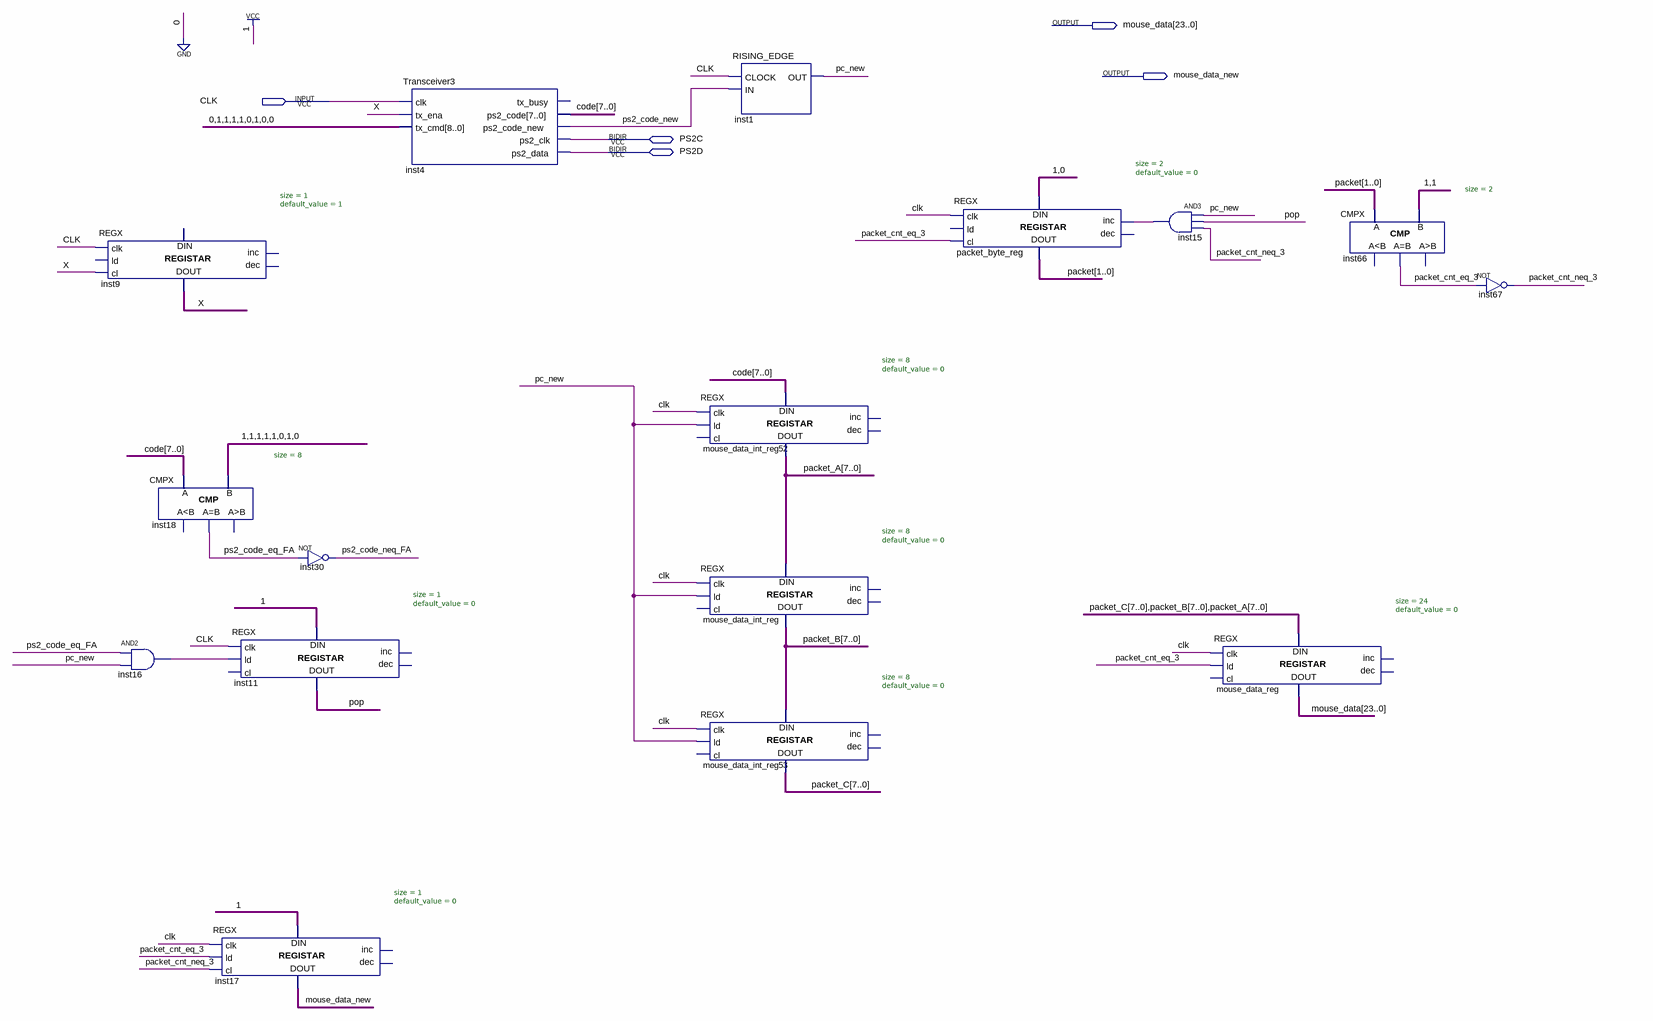
[diagram p0: schematic sheet]
// Quartus schematic transmit_test.bdf as structural Verilog: 16 symbols, 5 pins
module transmit_test (
  input  CLK,
  inout  PS2C,
  inout  PS2D,
  output [23:0] mouse_data,
  output mouse_data_new
);

  wire inst15_out, inst16_out, packet_cnt_eq_3, packet_cnt_neq_3, pc_new, pop, ps2_code_eq_FA,
       ps2_code_neq_FA, ps2_code_new, X;
  wire [1:0] packet;
  wire [7:0] code, packet_A, packet_B, packet_C;

  REGX #(.size(1), .default_value(1)) inst9 (.clk(CLK), .cl(X), .data_out(X));  // open: ld, inc, dec, data_in
  and inst16 (inst16_out, ps2_code_eq_FA, pc_new);
  CMPX #(.size(8)) inst18 (.A(code), .B(8'b11111010), .eq(ps2_code_eq_FA));  // open: ls, gr
  REGX #(.size(1), .default_value(0)) inst11 (
    .clk(CLK), .ld(inst16_out), .data_in(1'b1), .data_out(pop));  // open: cl, inc, dec
  REGX #(.size(1), .default_value(0)) inst17 (
    .clk(CLK), .ld(packet_cnt_eq_3), .cl(packet_cnt_neq_3), .data_in(1'b1), .data_out(mouse_data_new));  // open: inc, dec
  not inst30 (ps2_code_neq_FA, ps2_code_eq_FA);
  Transceiver3 inst4 (
    .clk(CLK), .tx_ena(X), .tx_cmd(9'b011110100), .ps2_code(code), .ps2_code_new(ps2_code_new),
    .ps2_clk(PS2C), .ps2_data(PS2D));  // open: tx_busy
  RISING_EDGE inst1 (.CLOCK(CLK), .IN(ps2_code_new), .OUT(pc_new));
  REGX #(.size(8), .default_value(0)) mouse_data_int_reg52 (
    .clk(CLK), .ld(pc_new), .data_in(code), .data_out(packet_A));  // open: cl, inc, dec
  REGX #(.size(8), .default_value(0)) mouse_data_int_reg (
    .clk(CLK), .ld(pc_new), .data_in(packet_A), .data_out(packet_B));  // open: cl, inc, dec
  REGX #(.size(8), .default_value(0)) mouse_data_int_reg53 (
    .clk(CLK), .ld(pc_new), .data_in(packet_B), .data_out(packet_C));  // open: cl, inc, dec
  REGX #(.size(2), .default_value(0)) packet_byte_reg (
    .clk(CLK), .cl(packet_cnt_eq_3), .inc(inst15_out), .data_in(2'b10), .data_out(packet));  // open: ld, dec
  and inst15 (inst15_out, pc_new, pop, packet_cnt_neq_3);
  REGX #(.size(24), .default_value(0)) mouse_data_reg (
    .clk(CLK), .ld(packet_cnt_eq_3), .data_in({packet_C, packet_B, packet_A}), .data_out(mouse_data));  // open: cl, inc, dec
  CMPX #(.size(2)) inst66 (.A(packet), .B(2'b11), .eq(packet_cnt_eq_3));  // open: ls, gr
  not inst67 (packet_cnt_neq_3, packet_cnt_eq_3);
endmodule
